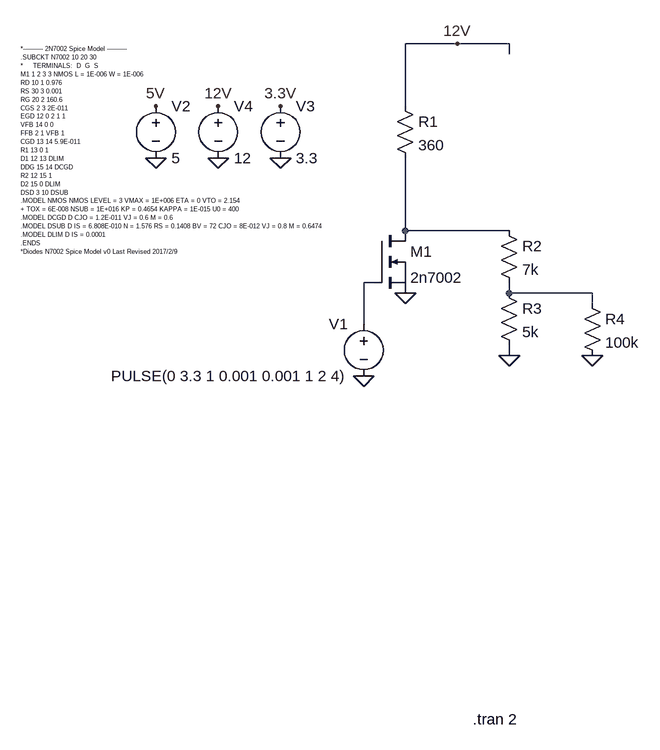
[diagram p0: schematic TSAL Driver.asc]
TSAL Driver.asc, the LTspice schematic file:
Version 4
SHEET 1 2392 680
WIRE 64 -656 -16 -656
WIRE 144 -656 64 -656
WIRE 144 -640 144 -656
WIRE -16 -560 -16 -656
WIRE -16 -368 -16 -480
WIRE 144 -368 -16 -368
WIRE -64 -288 -80 -288
WIRE 144 -272 144 -288
WIRE 272 -272 144 -272
WIRE 272 -256 272 -272
WIRE -80 -224 -80 -288
WIRE 144 -176 144 -192
FLAG -80 -144 0
FLAG -16 -272 0
FLAG -400 -480 0
FLAG -400 -560 5V
FLAG 64 -656 12V
FLAG -304 -480 0
FLAG -304 -560 12V
FLAG -208 -480 0
FLAG -208 -560 3.3V
FLAG 144 -176 0
FLAG 272 -176 0
SYMBOL voltage -80 -240 M0
WINDOW 123 0 0 Left 0
WINDOW 39 0 0 Left 0
SYMATTR InstName V1
SYMATTR Value PULSE(0 3.3 1 0.001 0.001 1 2 4)
SYMBOL nmos -64 -368 R0
SYMATTR InstName M1
SYMATTR Value 2n7002
SYMBOL res -32 -576 R0
SYMATTR InstName R1
SYMATTR Value 360
SYMBOL voltage -400 -576 R0
WINDOW 123 0 0 Left 0
WINDOW 39 0 0 Left 0
SYMATTR InstName V2
SYMATTR Value 5
SYMBOL voltage -304 -576 R0
WINDOW 123 0 0 Left 0
WINDOW 39 0 0 Left 0
SYMATTR InstName V4
SYMATTR Value 12
SYMBOL voltage -208 -576 R0
WINDOW 123 0 0 Left 0
WINDOW 39 0 0 Left 0
SYMATTR InstName V3
SYMATTR Value 3.3
SYMBOL res 128 -384 R0
SYMATTR InstName R2
SYMATTR Value 7k
SYMBOL res 128 -288 R0
SYMATTR InstName R3
SYMATTR Value 5k
SYMBOL res 256 -272 R0
SYMATTR InstName R4
SYMATTR Value 100k
TEXT 88 384 Left 2 !.tran 2
TEXT -608 -648 Left 0 !*---------- 2N7002 Spice Model ----------\n.SUBCKT N7002 10 20 30 \n*     TERMINALS:  D  G  S\nM1 1 2 3 3 NMOS L = 1E-006 W = 1E-006 \nRD 10 1 0.976 \nRS 30 3 0.001 \nRG 20 2 160.6 \nCGS 2 3 2E-011 \nEGD 12 0 2 1 1 \nVFB 14 0 0 \nFFB 2 1 VFB 1 \nCGD 13 14 5.9E-011 \nR1 13 0 1 \nD1 12 13 DLIM \nDDG 15 14 DCGD \nR2 12 15 1 \nD2 15 0 DLIM \nDSD 3 10 DSUB \n.MODEL NMOS NMOS LEVEL = 3 VMAX = 1E+006 ETA = 0 VTO = 2.154 \n+ TOX = 6E-008 NSUB = 1E+016 KP = 0.4654 KAPPA = 1E-015 U0 = 400 \n.MODEL DCGD D CJO = 1.2E-011 VJ = 0.6 M = 0.6 \n.MODEL DSUB D IS = 6.808E-010 N = 1.576 RS = 0.1408 BV = 72 CJO = 8E-012 VJ = 0.8 M = 0.6474 \n.MODEL DLIM D IS = 0.0001 \n.ENDS\n*Diodes N7002 Spice Model v0 Last Revised 2017/2/9

The netlist it stands for:
* TSAL Driver.asc
V1 N002 0 PULSE(0 3.3 1 0.001 0.001 1 2 4)
M1 N001 N002 0 0 2n7002
R1 12V N001 360
V2 5V 0 5
V4 12V 0 12
V3 3.3V 0 3.3
R2 N001 N003 7k
R3 N003 0 5k
R4 N003 0 100k
.model NMOS NMOS
.model PMOS PMOS
.lib standard.mos
.tran 2
*---------- 2N7002 Spice Model ----------
.SUBCKT N7002 10 20 30
*     TERMINALS:  D  G  S
M1 1 2 3 3 NMOS L = 1E-006 W = 1E-006
RD 10 1 0.976
RS 30 3 0.001
RG 20 2 160.6
CGS 2 3 2E-011
EGD 12 0 2 1 1
VFB 14 0 0
FFB 2 1 VFB 1
CGD 13 14 5.9E-011
R1 13 0 1
D1 12 13 DLIM
DDG 15 14 DCGD
R2 12 15 1
D2 15 0 DLIM
DSD 3 10 DSUB
.MODEL NMOS NMOS LEVEL = 3 VMAX = 1E+006 ETA = 0 VTO = 2.154
+ TOX = 6E-008 NSUB = 1E+016 KP = 0.4654 KAPPA = 1E-015 U0 = 400
.MODEL DCGD D CJO = 1.2E-011 VJ = 0.6 M = 0.6
.MODEL DSUB D IS = 6.808E-010 N = 1.576 RS = 0.1408 BV = 72 CJO = 8E-012 VJ = 0.8 M = 0.6474
.MODEL DLIM D IS = 0.0001
.ENDS
*Diodes N7002 Spice Model v0 Last Revised 2017/2/9
.backanno
.end